# Altium schematic sheet Power Input.SchDoc
size A4; SheetNumber: 5; SheetTotal: 5; SPICEModelCacheNFRRDGBC: <root> / <DocumentId>NFRRDGBC</DocumentId> / </root>
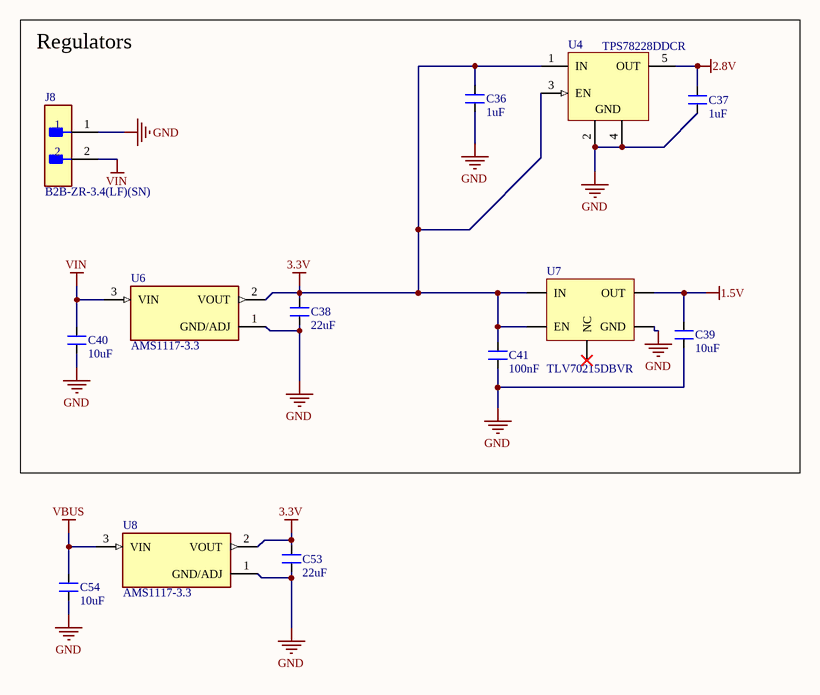
[diagram p0: Power Input.SchDoc]

## Parts
C36  1uF  [CAP_0805]
C37  1uF  [CAP_0805]
C38  22uF  [CAP_0805]
C39  10uF  [CAP_0805]
C40  10uF  [CAP_0805]
C41  100nF  [CAP_0805]
C53  22uF  [CAP_0805]
C54  10uF  [CAP_0805]
J8  B2B-ZR-3.4(LF)(SN)  [FP-B2B-ZR-3_4_LF_SN-MFG]
U4  TPS78228DDCR  [DDC0005A_L]
U6  AMS1117-3.3  [SOT229P700X180-4N]
U7  TLV70215DBVR  [TLV70215DBVR]
U8  AMS1117-3.3  [SOT229P700X180-4N]

## Blocks framed on the sheet
Regulators: C36-C41 J8 U4 U6 U7

## Nets
1.5V: C39.2 U7.5(OUT)
2.8V: C37.2 U4.5(OUT)
3.3V: C36.2 C38.2 C41.2 C53.2 U4.1(IN) U4.3(EN) U6.2(VOUT) U7.1(IN) U7.3(EN) U8.2(VOUT)
GND: C36.1 C37.1 C38.1 C39.1 C40.1 C41.1 C53.1 C54.1 J8.1 U4.2(GND) U4.4(GND) U6.1(GND/ADJ) U7.2(GND) U8.1(GND/ADJ)
VBUS: C54.2 U8.3(VIN)
VIN: C40.2 J8.2 U6.3(VIN)

Not connected (* = marked no-connect by the designer): U7 4(NC)*

## Notes on the sheet
- Title:
- Enigneer:
- Page Contents:
- Company:
- Size:
- Date:
- File:
- Website:
- A4
- Number:
- Time:
- Revision:
- Sheet

## Library data of the parts
C36 C37 C39-C41 C54 = CAP_10nF-50V-10%-0805: 10000pF ±10% 50V Ceramic Capacitor X7R 0805 (2012 Metric); Manufacturer: Samsung; Manufacturer Part Number: C0805C103K5RECAUTO; Alternate Part Number-1: GRM2195C1H103JA01D; Case/Package: 0805; Supplier-1: SIRICOM; Supplier Part Number-1: 0805B103K500CT
C38 C53 = CAP_22uF-25V-20%-0805: 22µF ±20% 25V Ceramic Capacitor X5R 0805 (2012 Metric); Manufacturer: Murata; Manufacturer Part Number: GRM21BR61E226ME44L; Alternate Part Number-1: NA; Case/Package: 0805; Supplier-1: LCSC; Supplier Part Number-1: C86816
J8 = CMP-17439-000601-1: CONN HEADER VERT 2POS 1.5MM; Mated Stacking Heights: 5.6mm; Voltage Rating: 50V; Number of Positions: 2; Termination: Press-Fit; Insulation Color: Natural; Pitch: 1.5mm; Number of Rows: 1; Fastening Type: Detent; Insulation Material: Nylon; Contact Shape: Circular; Lead Free: Lead Free; Series: ZH; Connector Type: Header; Contact Type: Male Pin; Packaging: Bulk; Contact Finish - Mating: TIN; Mount: Through Hole; Contact Material: Brass; Flammability Rating: UL94 V-0
U4 = CMP-0394-01012-2: Single Output LDO, 150 mA, Fixed 2.8 V Output, 2.2 to 5.5 V Input, with 0.5 uA Quiescent Current, 5-pin SOT (DDC), -40 to 85 degC, Green (RoHS & no Sb/Br); Manufacturer: Texas Instruments; Vout Adj(Min)(V): 2.8; SubFamily: Single Channel LDO; Iout(Max)(A): 0.15; Vin(Max)(V): 5.5; Rating: Catalog; Vin(Min)(V): 2.2; Iq(Typ)(mA): 0.0005; Accuracy(%): 3; Vdo(Typ)(mV): 130; Fixed Output Options(V): 2.8; Mounting Technology: Surface Mount; ComponentLink2URL: http://www.ti.com/general/docs/lit/getliterature.tsp?genericPartNumber=TPS78228&fileType=pdf; ComponentLink3Description: Package Specification; Code_JEDEC: MO-193; ComponentLink2Description: Datasheet; PackageReference: DDC0005A; ComponentLink3URL: http://www.ti.com/litv/pdf/mpds123d; ComponentLink1URL: http://www.ti.com/; DatasheetVersion: SBVS115B; ComponentLink1Description: Manufacturer URL; PackageDescription: 5-Pin Plastic Small Outline, Body 2.9 x 1.6 mm, 0.95 mm Pitch; Vout Adj(Max)(V): 2.8; Eco-Plan: Green (RoHS & no Sb/Br); PackageVersion: 4204403-2/E; PartNumber: TPS78228DDCR
U6 U8 = AMS1117-3.3: Sot223/Pkg 1-Amp 3.3-Volt Low Drop Out Voltage Regulatator; MF: Advanced Monolithic Systems; Package: SOT-223 Seeed Technology; Value: *; Check_prices: https://www.snapeda.com/parts/AMS1117-3.3/Advanced+Monolithic+Systems/view-part/?ref=eda; Price: None; Availability: Not in stock; MP: AMS1117-3.3; SnapEDA_Link: https://www.snapeda.com/parts/AMS1117-3.3/Advanced+Monolithic+Systems/view-part/?ref=snap